# Altium schematic sheet PowerSupply.SchDoc
size A
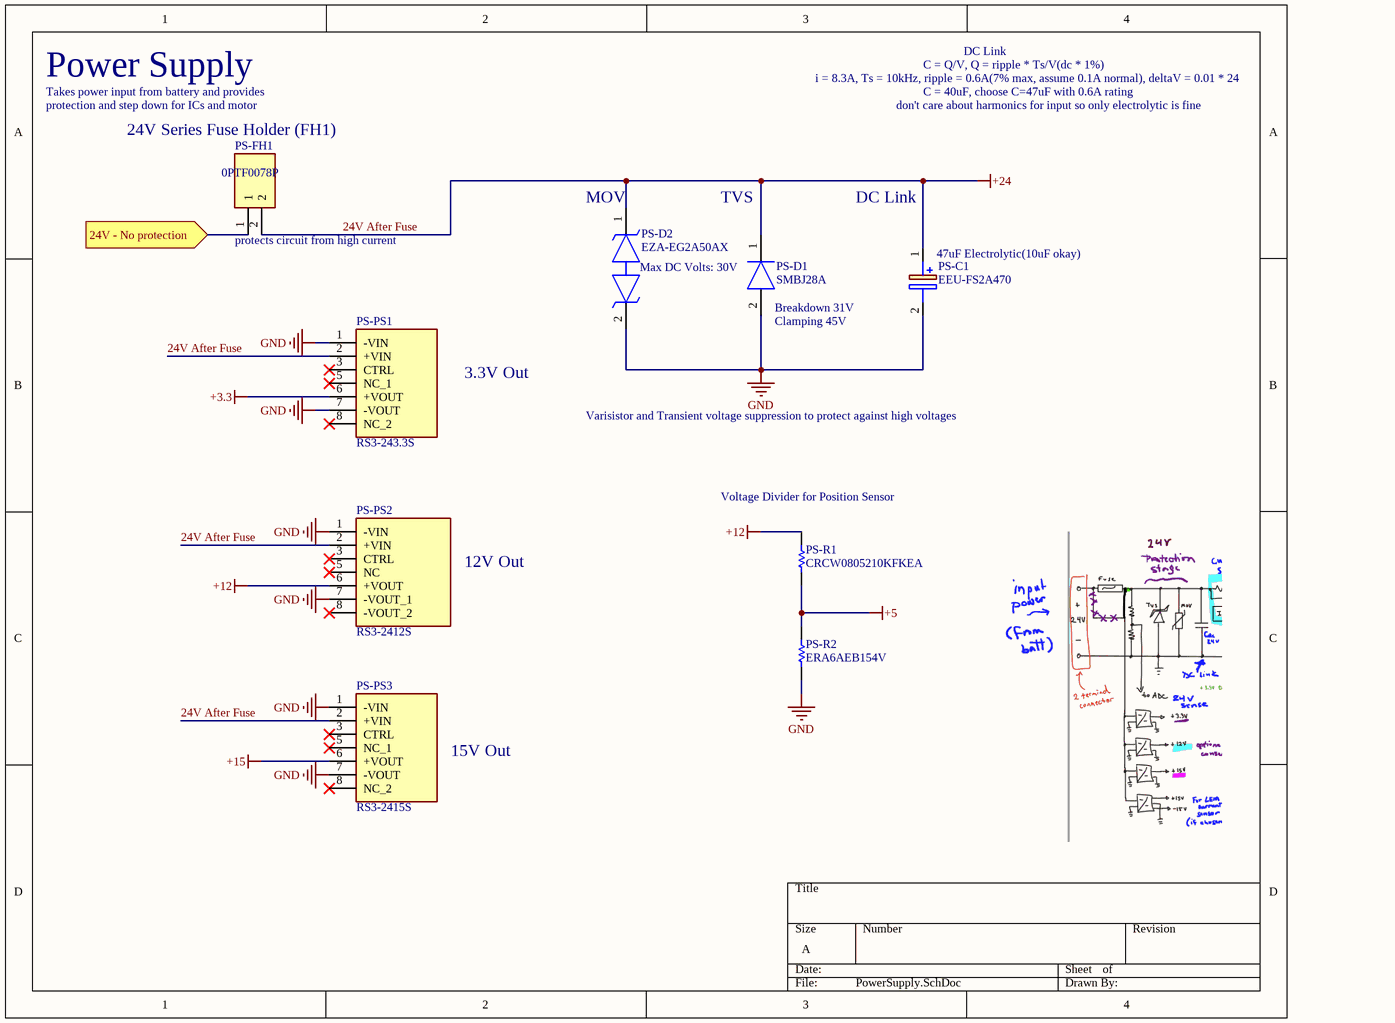
[diagram p0: PowerSupply.SchDoc]

## Parts
PS-C1  EEU-FS2A470  [CAPPRD350W65D800H1650]
PS-D1  SMBJ28A  [DIOM5436X261N]
PS-D2  EZA-EG2A50AX  [DIONC1005X43N]
PS-FH1  0PTF0078P  [0PTF0078P]
PS-PS1  RS3-243.3S  [RS32433S]
PS-PS2  RS3-2412S  [RS32415S]
PS-PS3  RS3-2415S  [RS32415S]
PS-R1  CRCW0805210KFKEA  [RESC2013X50X30LL20T20]
PS-R2  ERA6AEB154V  [RESC2013X60X40LL20T25]

## Ports
24V - No protection (in)

## Nets
24V After Fuse: PS-C1.1(+) PS-D1.1(K) PS-D2.1 PS-FH1.2 PS-PS1.2(+VIN) PS-PS2.2(+VIN) PS-PS3.2(+VIN)  [also labelled +24]
+3.3: PS-PS1.6(+VOUT)
+5: PS-R1.1 PS-R2.2
+12: PS-PS2.6(+VOUT) PS-R1.2
+15: PS-PS3.6(+VOUT)
GND: PS-C1.2(-) PS-D1.2(A) PS-D2.2 PS-PS1.1(-VIN) PS-PS1.7(-VOUT) PS-PS2.1(-VIN) PS-PS2.7(-VOUT_1) PS-PS3.1(-VIN) PS-PS3.7(-VOUT) PS-R2.1
24V - No protection: PS-FH1.1 ; port 24V - No protection

Not connected (* = marked no-connect by the designer): PS-PS1 3(CTRL)* 5(NC_1)* 8(NC_2)*; PS-PS2 3(CTRL)* 5(NC)* 8(-VOUT_2)*; PS-PS3 3(CTRL)* 5(NC_1)* 8(NC_2)*

## Notes on the sheet
- Power Supply
- Takes power input from battery and provides
- i = 8.3A, Ts = 10kHz, ripple = 0.6A(7% max, assume 0.1A normal), deltaV = 0.01 * 24
- C = Q/V, Q = ripple * Ts/V(dc * 1%)
- C = 40uF, choose C=47uF with 0.6A rating
- DC Link
- protection and step down for ICs and motor
- 24V Series Fuse Holder (FH1)
- don't care about harmonics for input so only electrolytic is fine
- (near PS-D2) MOV
- TVS
- (near PS-FH1) protects circuit from high current
- Max DC Volts: 30V
- (near PS-C1) 47uF Electrolytic(10uF okay)
- (near PS-D1) Breakdown 31V
- (near PS-D1) Clamping 45V
- 3.3V Out
- Varisistor and Transient voltage suppression to protect against high voltages
- (near PS-R1) Voltage Divider for Position Sensor
- 12V Out
- 15V Out

## Library data of the parts
PS-C1 = EEU-FS2A470: Capacitor Polarised 47uF; Manufacturer_Name: Panasonic; Datasheet Link: https://componentsearchengine.com/Datasheets/1/EEU-FS2A470.pdf; Height: 16.5mm; Manufacturer_Part_Number: EEU-FS2A470; Mouser Part Number: 667-EEU-FS2A470; Mouser Price/Stock: https://www.mouser.co.uk/ProductDetail/Panasonic/EEU-FS2A470?qs=w%2Fv1CP2dgqrDlaRaE647gA%3D%3D; Arrow Part Number: EEU-FS2A470; Arrow Price/Stock: https://www.arrow.com/en/products/eeu-fs2a470/panasonic
PS-D1 = SMBJ28A: Diode; Manufacturer_Name: LITTELFUSE; Datasheet Link: https://componentsearchengine.com/Datasheets/2/SMBJ28A.pdf; Height: 2.61mm; Manufacturer_Part_Number: SMBJ28A; Mouser Part Number: 576-SMBJ28A; Mouser Price/Stock: https://www.mouser.co.uk/ProductDetail/Littelfuse/SMBJ28A?qs=JJML70Qc14vmSTVTa1LvqQ%3D%3D; Arrow Part Number: SMBJ28A; Arrow Price/Stock: https://www.arrow.com/en/products/smbj28a/littelfuse
PS-D2 = EZA-EG2A50AX: TVS Diode (Bi-directional); Manufacturer_Name: Panasonic; Datasheet Link: https://industrial.panasonic.com/cdbs/www-data/pdf/AWD0000/AWD0000C23.pdf; Height: 0.43mm; Manufacturer_Part_Number: EZA-EG2A50AX; Mouser Part Number: 667-EZA-EG2A50AX; Mouser Price/Stock: https://www.mouser.co.uk/ProductDetail/Panasonic/EZA-EG2A50AX?qs=WwqriLBepZuVGjkTEFYPQg%3D%3D; Arrow Part Number: EZA-EG2A50AX; Arrow Price/Stock: https://www.arrow.com/en/products/eza-eg2a50ax/panasonic
PS-FH1 = 0PTF0078P: Undefined or Miscellaneous; Manufacturer_Name: LITTELFUSE; Datasheet Link: https://media.digikey.com/pdf/Data%20Sheets/Littelfuse%20PDFs/PTF075_77_78.pdf; Height: 11.5mm; Manufacturer_Part_Number: 0PTF0078P; Mouser Part Number: 576-0PTF0078P; Mouser Price/Stock: https://www.mouser.co.uk/ProductDetail/Littelfuse/0PTF0078P?qs=Co4VkB5J4%2Fsczy6gG8s%2FsA%3D%3D; Arrow Part Number: 0PTF0078P; Arrow Price/Stock: https://www.arrow.com/en/products/0ptf0078p/littelfuse
PS-PS1 = RS3-243.3S: Power Supply; Manufacturer_Name: RECOM Power; Datasheet Link: https://www.arrow.com/en/products/rs3-243.3s/recom-power; Height: 11.35mm; Manufacturer_Part_Number: RS3-243.3S; Mouser Part Number: 919-RS3-243.3S; Mouser Price/Stock: https://www.mouser.com/Search/Refine.aspx?Keyword=919-RS3-243.3S; Arrow Part Number: RS3-243.3S; Arrow Price/Stock: https://www.arrow.com/en/products/rs3-243.3s/recom-power
PS-PS2 = RS3-2412S: Power Supply 12V; Manufacturer_Name: RECOM Power; Datasheet Link: https://www.recom-power.com/pdf/Econoline/RS3-S_D_Z.pdf; Manufacturer_Part_Number: RS3-2412S; Mouser Part Number: 919-RS3-2412S; Mouser Price/Stock: https://www.mouser.com/Search/Refine.aspx?Keyword=919-RS3-2412S; RS Part Number: 1669097; RS Price/Stock: https://uk.rs-online.com/web/p/products/1669097
PS-PS3 = RS3-2415S: Power Supply; Manufacturer_Name: RECOM Power; Datasheet Link: https://www.recom-power.com/pdf/Econoline/RS3-S_D_Z.pdf; Height: 11.35mm; Manufacturer_Part_Number: RS3-2415S; Mouser Part Number: 919-RS3-2415S; Mouser Price/Stock: https://www.mouser.com/Search/Refine.aspx?Keyword=919-RS3-2415S
PS-R1 = CMP-1013-00770-2: Manufacturer: Vishay Dale; Part Number: CRCW0805210KFKEA
PS-R2 = CMP-2001-00599-1: Manufacturer: Panasonic; Part Number: ERA6AEB154V